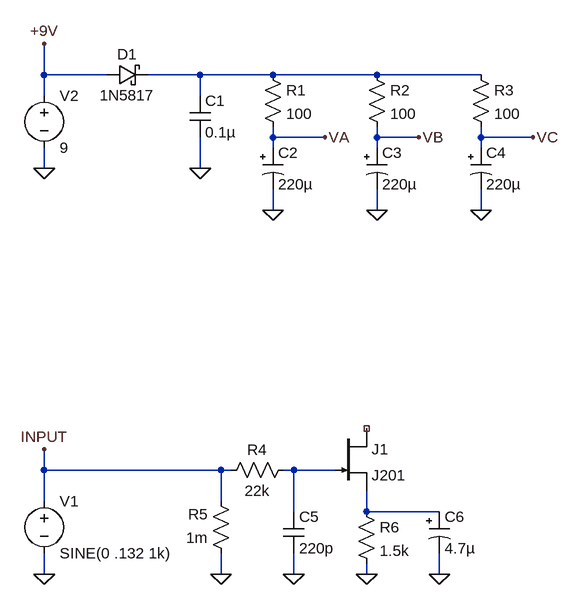
[diagram p0: schematic Draft1.asc]
Draft1.asc, the LTspice schematic file:
Version 4
SHEET 1 880 680
WIRE -640 -512 -640 -560
WIRE -544 -512 -640 -512
WIRE -400 -512 -480 -512
WIRE -288 -512 -400 -512
WIRE -128 -512 -288 -512
WIRE 32 -512 -128 -512
WIRE -640 -480 -640 -512
WIRE -400 -480 -400 -512
WIRE -288 -416 -288 -432
WIRE -208 -416 -288 -416
WIRE -128 -416 -128 -432
WIRE -64 -416 -128 -416
WIRE 32 -416 32 -432
WIRE 112 -416 32 -416
WIRE -288 -400 -288 -416
WIRE -128 -400 -128 -416
WIRE 32 -400 32 -416
WIRE -640 -368 -640 -400
WIRE -400 -368 -400 -416
WIRE -288 -304 -288 -336
WIRE -128 -304 -128 -336
WIRE 32 -304 32 -336
WIRE -640 96 -640 64
WIRE -368 96 -640 96
WIRE -352 96 -368 96
WIRE -256 96 -272 96
WIRE -192 96 -256 96
WIRE -640 144 -640 96
WIRE -368 144 -368 96
WIRE -256 160 -256 96
WIRE -144 160 -144 128
WIRE -32 160 -144 160
WIRE -640 256 -640 224
WIRE -368 256 -368 224
WIRE -256 256 -256 224
WIRE -144 256 -144 240
WIRE -32 256 -32 224
FLAG -640 256 0
FLAG -640 -368 0
FLAG -640 -560 +9V
FLAG -640 64 INPUT
FLAG -400 -368 0
FLAG -288 -304 0
FLAG -128 -304 0
FLAG 32 -304 0
FLAG -208 -416 VA
FLAG -64 -416 VB
FLAG 112 -416 VC
FLAG -368 256 0
FLAG -256 256 0
FLAG -144 256 0
FLAG -32 256 0
SYMBOL voltage -640 128 R0
WINDOW 123 0 0 Left 0
WINDOW 39 0 0 Left 0
SYMATTR InstName V1
SYMATTR Value SINE(0 .132 1k)
SYMBOL voltage -640 -496 R0
WINDOW 123 0 0 Left 0
WINDOW 39 0 0 Left 0
SYMATTR InstName V2
SYMATTR Value 9
SYMBOL schottky -544 -496 R270
WINDOW 0 32 32 VTop 2
WINDOW 3 0 32 VBottom 2
SYMATTR InstName D1
SYMATTR Value 1N5817
SYMATTR Description Diode
SYMATTR Type diode
SYMBOL cap -416 -480 R0
SYMATTR InstName C1
SYMATTR Value 0.1µ
SYMATTR SpiceLine V=50 Irms=835m Rser=0.0936732 Lser=0 mfg="KEMET" pn="C1812C104K5RAC" type="X7R"
SYMBOL polcap -304 -400 R0
WINDOW 3 24 56 Left 2
SYMATTR InstName C2
SYMATTR Value 220µ
SYMATTR Description Capacitor
SYMATTR Type cap
SYMATTR SpiceLine V=35 Irms=570m Rser=0.123 Lser=20.8n mfg="Würth Elektronik" pn="865080553014 WCAP-ASLI 8x10,5" type="Al electrolytic"
SYMBOL polcap -144 -400 R0
WINDOW 3 24 56 Left 2
SYMATTR InstName C3
SYMATTR Value 220µ
SYMATTR Description Capacitor
SYMATTR Type cap
SYMATTR SpiceLine V=35 Irms=570m Rser=0.123 Lser=20.8n mfg="Würth Elektronik" pn="865080553014 WCAP-ASLI 8x10,5" type="Al electrolytic"
SYMBOL polcap 16 -400 R0
WINDOW 3 24 56 Left 2
SYMATTR InstName C4
SYMATTR Value 220µ
SYMATTR Description Capacitor
SYMATTR Type cap
SYMATTR SpiceLine V=35 Irms=570m Rser=0.123 Lser=20.8n mfg="Würth Elektronik" pn="865080553014 WCAP-ASLI 8x10,5" type="Al electrolytic"
SYMBOL res -304 -528 R0
SYMATTR InstName R1
SYMATTR Value 100
SYMATTR SpiceLine tol=1 pwr=0.125
SYMBOL res -144 -528 R0
SYMATTR InstName R2
SYMATTR Value 100
SYMATTR SpiceLine tol=1 pwr=0.125
SYMBOL res 16 -528 R0
SYMATTR InstName R3
SYMATTR Value 100
SYMATTR SpiceLine tol=1 pwr=0.125
SYMBOL njf -192 32 R0
SYMATTR InstName J1
SYMATTR Value J201
SYMBOL res -256 80 R90
WINDOW 0 0 56 VBottom 2
WINDOW 3 32 56 VTop 2
SYMATTR InstName R4
SYMATTR Value 22k
SYMBOL res -352 240 R180
WINDOW 0 36 76 Left 2
WINDOW 3 36 40 Left 2
SYMATTR InstName R5
SYMATTR Value 1m
SYMBOL cap -272 160 R0
SYMATTR InstName C5
SYMATTR Value 220p
SYMATTR SpiceLine V=25 Irms=0 Rser=0.5863 Lser=330p mfg="Würth Elektronik" pn="885012206055 WCAP-CSGP 0603" type="X7R"
SYMBOL res -160 144 R0
SYMATTR InstName R6
SYMATTR Value 1.5k
SYMATTR SpiceLine tol=1 pwr=0.1
SYMBOL polcap -48 160 R0
WINDOW 3 24 56 Left 2
SYMATTR InstName C6
SYMATTR Value 4.7µ
SYMATTR Description Capacitor
SYMATTR Type cap
SYMATTR SpiceLine V=16 Irms=12m Rser=2.7041 Lser=1.39n mfg="Würth Elektronik" pn="865250340002 WCAP-ASNP 4x5,5" type="Al electrolytic"

The netlist it stands for:
* Draft1.asc
V1 INPUT 0 SINE(0 .132 1k)
V2 +9V 0 9
D1 +9V N001 1N5817
C1 N001 0 0.1µ V=50 Irms=835m Rser=0.0936732 Lser=0 mfg="KEMET" pn="C1812C104K5RAC" type="X7R"
C2 VA 0 220µ V=35 Irms=570m Rser=0.123 Lser=20.8n mfg="Würth Elektronik" pn="865080553014 WCAP-ASLI 8x10,5" type="Al electrolytic"
C3 VB 0 220µ V=35 Irms=570m Rser=0.123 Lser=20.8n mfg="Würth Elektronik" pn="865080553014 WCAP-ASLI 8x10,5" type="Al electrolytic"
C4 VC 0 220µ V=35 Irms=570m Rser=0.123 Lser=20.8n mfg="Würth Elektronik" pn="865080553014 WCAP-ASLI 8x10,5" type="Al electrolytic"
R1 N001 VA 100 tol=1 pwr=0.125
R2 N001 VB 100 tol=1 pwr=0.125
R3 N001 VC 100 tol=1 pwr=0.125
J1 NC_01 N002 N003 J201
R4 N002 INPUT 22k
R5 0 INPUT 1m
C5 N002 0 220p V=25 Irms=0 Rser=0.5863 Lser=330p mfg="Würth Elektronik" pn="885012206055 WCAP-CSGP 0603" type="X7R"
R6 N003 0 1.5k tol=1 pwr=0.1
C6 N003 0 4.7µ V=16 Irms=12m Rser=2.7041 Lser=1.39n mfg="Würth Elektronik" pn="865250340002 WCAP-ASNP 4x5,5" type="Al electrolytic"
.model D D
.lib standard.dio
.model NJF NJF
.model PJF PJF
.lib standard.jft
.backanno
.end